# EAGLE design controle_moteur_fat_bjt (EAGLE 9.5.1)
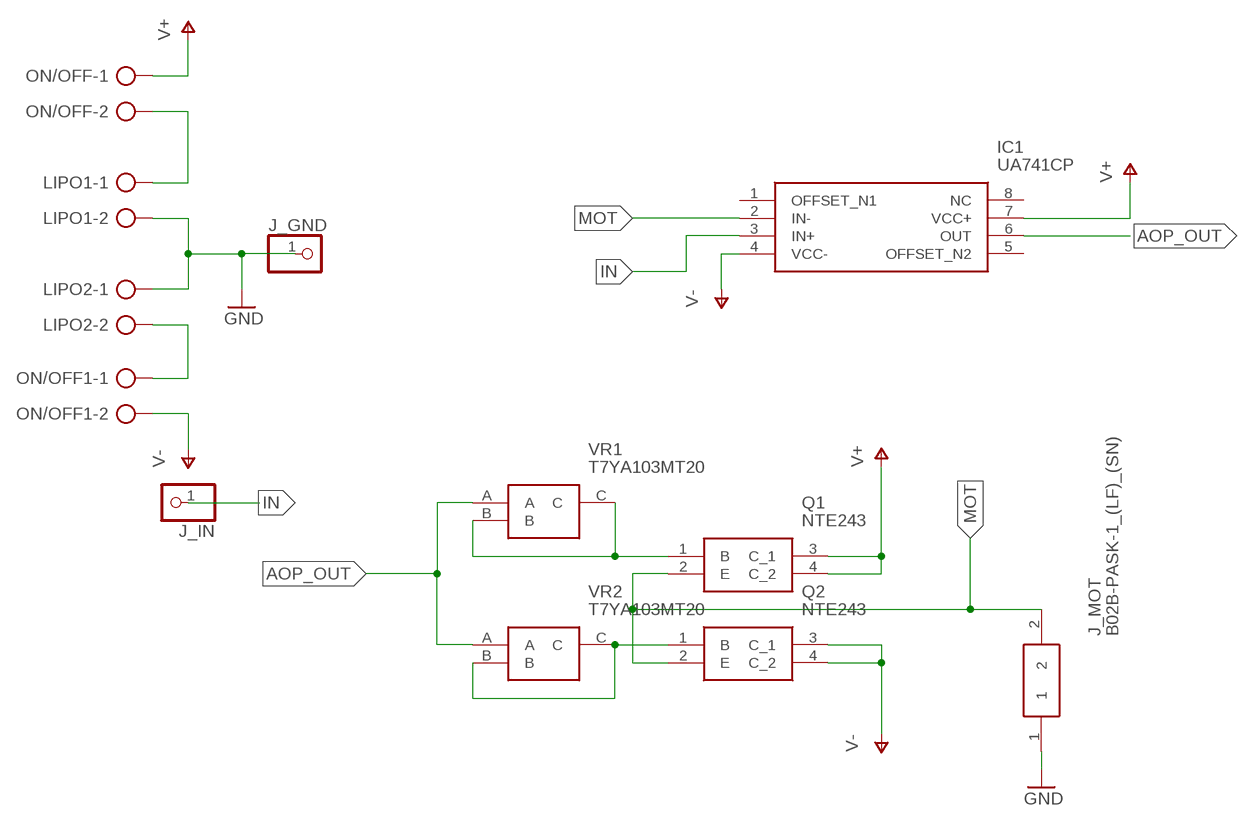
[diagram p0: schematic, sheet 1]

## Parts
IC1  UA741CP  [DIP794W53P254L959H508Q8N]
J_GND  PINHD-1X1  [1X01]
J_IN  PINHD-1X1  [1X01]
J_MOT  B02B-PASK-1_(LF)_(SN)  [B02BPASK1LFSN]
LIPO1  AK500/2  [AK500/2]
LIPO2  AK500/2  [AK500/2]
ON/OFF  AK500/2  [AK500/2]
ON/OFF1  AK500/2  [AK500/2]
Q1  NTE243  [NTE243]
Q2  NTE243  [NTE243]
VR1  T7YA103MT20  [T7YA]
VR2  T7YA103MT20  [T7YA]

## Nets
AOP_OUT: IC1.6(OUT) VR1.A VR2.A
GND: J_GND.1 J_MOT.1 LIPO1.2 LIPO2.1
IN: IC1.3(IN+) J_IN.1
MOT: IC1.2(IN-) J_MOT.2 Q1.2(E) Q2.2(E)
N$1: LIPO1.1 ON/OFF.2
N$2: Q1.1(B) VR1.B VR1.C
N$4: Q2.1(B) VR2.B VR2.C
V+: IC1.7(VCC+) ON/OFF.1 Q1.3(C_1) Q1.4(C_2)
V+1: LIPO2.2 ON/OFF1.1
V-: IC1.4(VCC-) ON/OFF1.2 Q2.3(C_1) Q2.4(C_2)
Unconnected: IC1.1(OFFSET_N1) IC1.5(OFFSET_N2) IC1.8(NC)

## Library data of the parts
IC1 = PFE:UA741CP: Single op-amp,UA741CP 1MHz DIP8, tube Texas Instruments UA741CP Op Amp, 1MHz, 8-Pin PDIP Source: Datasheet <http://www.ti.com/lit/ds/symlink/ua741.pdf>; DESCRIPTION: Single op-amp,UA741CP 1MHz DIP8, tube Texas Instruments UA741CP Op Amp, 1MHz, 8-Pin PDIP; HEIGHT: 5.08mm; MANUFACTURER_NAME: Texas Instruments; MANUFACTURER_PART_NUMBER: UA741CP; MOUSER_PART_NUMBER: 595-UA741CP; MOUSER_PRICE-STOCK: https://www.mouser.com/Search/Refine.aspx?Keyword=595-UA741CP; RS_PART_NUMBER: 0305311P; RS_PRICE-STOCK: http://uk.rs-online.com/web/p/products/0305311P
J_GND J_IN = pinhead:PINHD-1X1: PIN HEADER
J_MOT = PFE:B02B-PASK-1_(LF)_(SN): JST Polyamide Series, 2mm Pitch 2 Way 1 Row Straight PCB Header, Solder Termination, 3A Source: Datasheet <http://www.jst-mfg.com/product/pdf/eng/ePA-F.pdf>; DESCRIPTION: JST Polyamide Series, 2mm Pitch 2 Way 1 Row Straight PCB Header, Solder Termination, 3A; HEIGHT: 7mm; MANUFACTURER_NAME: JST (JAPAN SOLDERLESS TERMINALS); MANUFACTURER_PART_NUMBER: B02B-PASK-1 (LF) (SN); RS_PART_NUMBER: 5128585P; RS_PRICE-STOCK: http://uk.rs-online.com/web/p/products/5128585P
LIPO1 LIPO2 ON/OFF ON/OFF1 = con-ptr500:AK500/2: CONNECTOR; OC_FARNELL: unknown; OC_NEWARK: unknown
Q1 Q2 = PFE:NTE243: NTE ELECTRONICS - NTE243 - DARLINGTON TRANSISTOR, NPN, 80V, TO-3 Source: Datasheet <http://www.farnell.com/datasheets/199893.pdf>; ALLIED_NUMBER: 70214617; ALLIED_PRICE-STOCK: https://www.alliedelec.com/nteelectronics-inc-nte243/70214617/; DESCRIPTION: NTE ELECTRONICS - NTE243 - DARLINGTON TRANSISTOR, NPN, 80V, TO-3; HEIGHT: 8.89mm; MANUFACTURER_NAME: NTE ELECTRONICS; MANUFACTURER_PART_NUMBER: NTE243
VR1 VR2 = PFE:T7YA103MT20: Vishay T7YA Series Through Hole Trimmer Resistor with Pin Terminations, 10k +/-10% 1/2W +/-100ppm/C Top Adjust Source: Datasheet <https://docs-emea.rs-online.com/webdocs/0021/0900766b8002111f.pdf>; DESCRIPTION: Vishay T7YA Series Through Hole Trimmer Resistor with Pin Terminations, 10k +/-10% 1/2W +/-100ppm/C Top Adjust; HEIGHT: mm; MANUFACTURER_NAME: Vishay; MANUFACTURER_PART_NUMBER: T7YA103MT20; MOUSER_PART_NUMBER: N/A; MOUSER_PRICE-STOCK: https://www.mouser.com/Search/Refine.aspx?Keyword=N%2FA; RS_PART_NUMBER: 3746787P; RS_PRICE-STOCK: http://uk.rs-online.com/web/p/products/3746787P

## Board
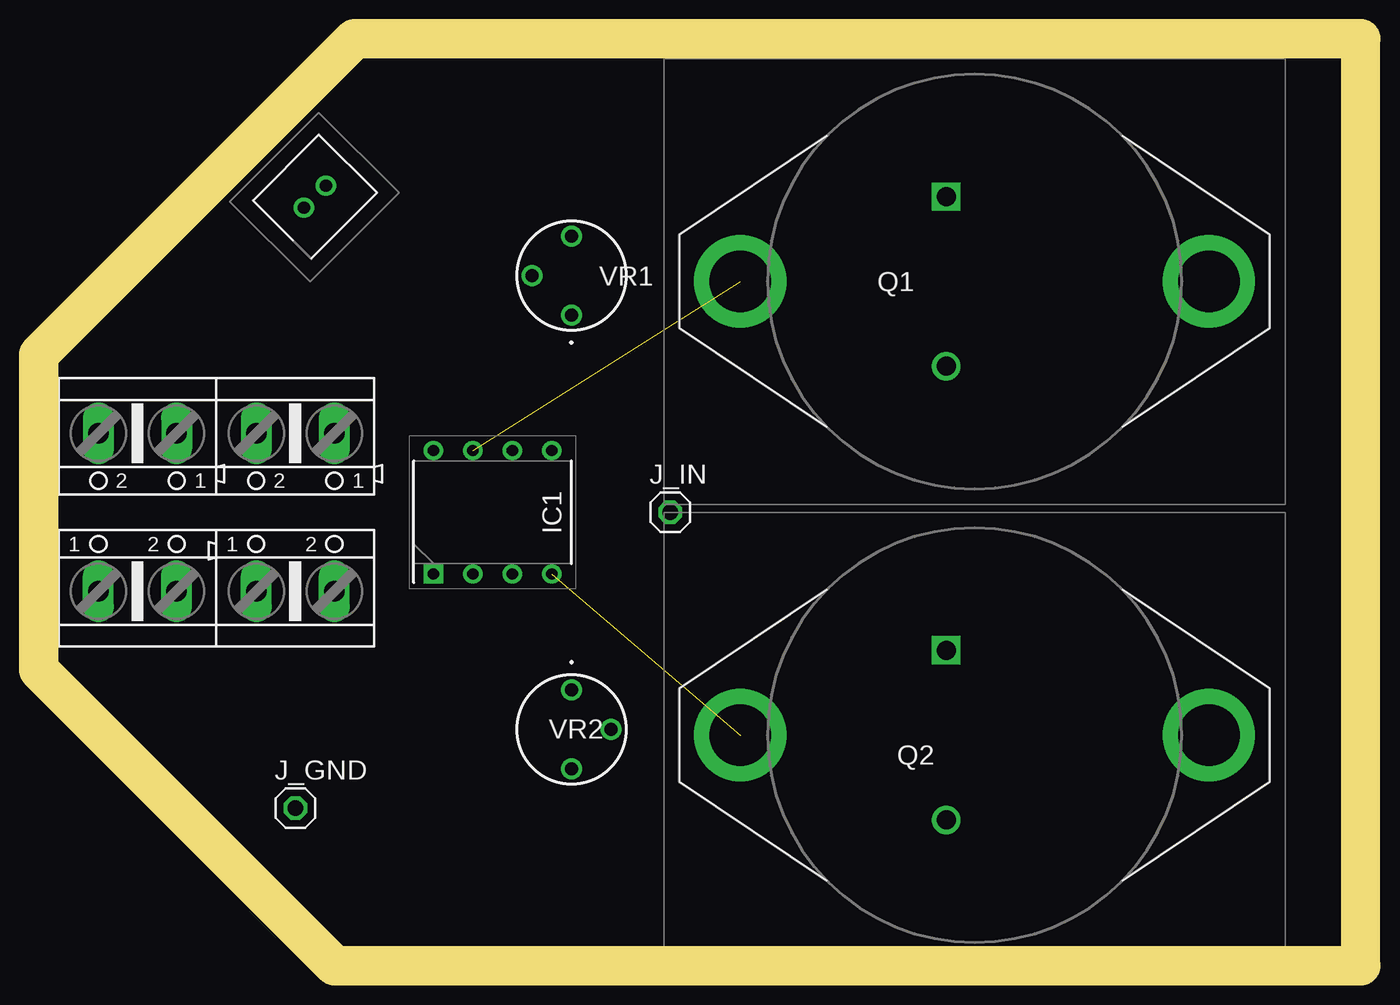
[diagram p1: board, top side]
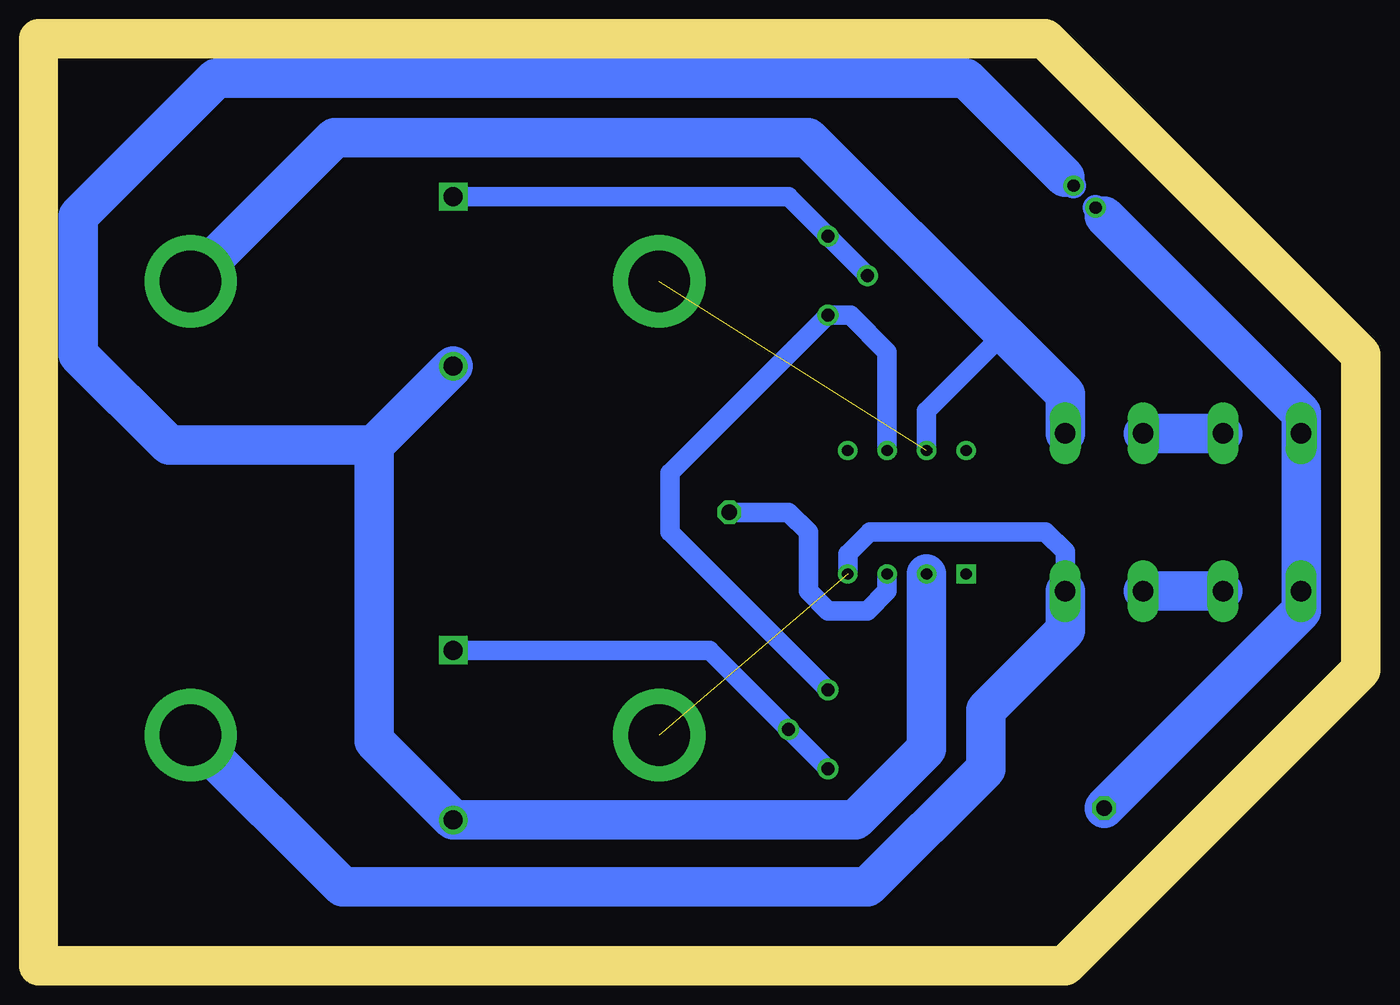
[diagram p2: board, bottom side, seen from below]

Size 85.09 x 59.69 mm. Coordinates in mm from the lower left corner, seen from the top.
Outline: 0,39.37 0,19.05
Outline: 0,19.05 19.05,0
Outline: 19.05,0 85.09,0
Outline: 85.09,0 85.09,59.69 20.32,59.69
Outline: 0,39.37 20.32,59.69
Outline: 0,39.37 0,19.05
Outline: 0,19.05 19.05,0
Outline: 19.05,0 85.09,0
Outline: 0,39.37 20.32,59.69
Copper layers (1*16): Top 0.035mm / dielectric 1.5mm / Bottom 0.035mm
Design rules "default *": minimum track width 6mil, minimum drill 0.35mm, track to track 10mil, track to pad 10mil, pad to pad 10mil, via to via 10mil, smd to smd 10mil, copper to edge 40mil, drill to drill 6mil, minimum pad ring 10mil, minimum via ring 8mil, stop-mask expansion 4mil, vias tented up to drill 0mil, thermal gap 10mil
Milling: 6 lines

### Footprints (pad centres in the part's own frame; a part is rotated, then mirrored left to right if it is on the bottom)
DIP794W53P254L959H508Q8N = drill 0.73 pad 1.13 square: 1 -3.97,3.81 | drill 0.73 pad 1.13: 2 -3.97,1.27; 3 -3.97,-1.27; 4 -3.97,-3.81; 5 3.97,-3.81; 6 3.97,-1.27; 7 3.97,1.27; 8 3.97,3.81
1X01 = drill 1.016 octagon: 1 0,0
B02BPASK1LFSN = drill 0.8 pad 1.3: 1 1,0; 2 -1,0
AK500/2 = drill 1.321 long: 1 -2.515,0; 2 2.515,0
NTE243 = drill 1.22 pad 1.83 square: 1 0,0 | drill 1.22 pad 1.83: 2 0,-10.92 | drill 3.96 pad 5.94: 3 16.9,-5.46; 4 -13.26,-5.46
T7YA = drill 0.84 pad 1.3: A 0,-2.54; B -2.54,0; C 0,2.54

### Placement (x,y rotation side)
IC1  29.21,29.21 90 top
J_GND  16.51,10.16 0 top
J_IN  40.64,29.21 0 top
J_MOT  17.78,49.53 225 top
LIPO1  6.35,34.29 180 top
LIPO2  6.35,24.13 0 top
ON/OFF  16.51,34.29 180 top
ON/OFF1  16.51,24.13 0 top
Q1  58.42,49.53 0 top
Q2  58.42,20.32 0 top
VR1  34.29,44.45 0 top
VR2  34.29,15.24 180 top

### Tracks (layer width: path | path; a pad name or v marks a point on that pad's centre or on a via)
AOP_OUT
  Bottom 1.27: VR2.A 44.45,27.94 44.45,31.75 VR1.A 32.86,41.91 30.48,39.53 IC1.6
GND
  Bottom 1.651: 16.51,48.26 J_MOT.1
  Bottom 2.54: 16.51,48.26 3.84,35.58 LIPO1.2 LIPO2.1 3.84,22.86 16.51,10.19 J_GND.1
IN
  Bottom 1.27: IC1.3 30.48,24.13 31.75,22.86 34.29,22.86 35.56,24.13 35.56,27.94 36.83,29.21 J_IN.1
MOT
  Bottom 1.651: 19.05,50.8 J_MOT.2
  Bottom 2.54: IC1.2 27.94,13.97 32.51,9.4 Q2.2 63.5,14.48 63.5,33.53 | 63.5,33.53 Q1.2 | 63.5,33.53 76.71,33.53 82.55,39.37 82.55,48.26 73.66,57.15 25.4,57.15 19.05,50.8
N$1
  Bottom 2.54: LIPO1.1 ON/OFF.2
N$2
  Bottom 1.27: VR1.B VR1.C 36.83,49.53 Q1.1
N$4
  Bottom 1.27: VR2.C VR2.B 41.91,20.32 Q2.1
V+  (1 unrouted)
  Bottom 1.27: IC1.7 27.94,35.72 23,40.66 22.91,40.66 22.86,40.66
  Bottom 2.54: 22.86,40.66 19.03,36.83 ON/OFF.1 | 22.86,40.61 22.91,40.66 35.58,53.34 66.05,53.34 Q1.3
V+1
  Bottom 2.54: LIPO2.2 ON/OFF1.1
V-  (1 unrouted)
  Bottom 1.27: IC1.4 33.02,26.51 31.59,27.94 20.3,27.94 19.03,26.67 ON/OFF1.2
  Bottom 2.54: Q2.3 65.54,5.08 31.75,5.08 24.13,12.7 24.13,16.48 19.03,21.59 ON/OFF1.2